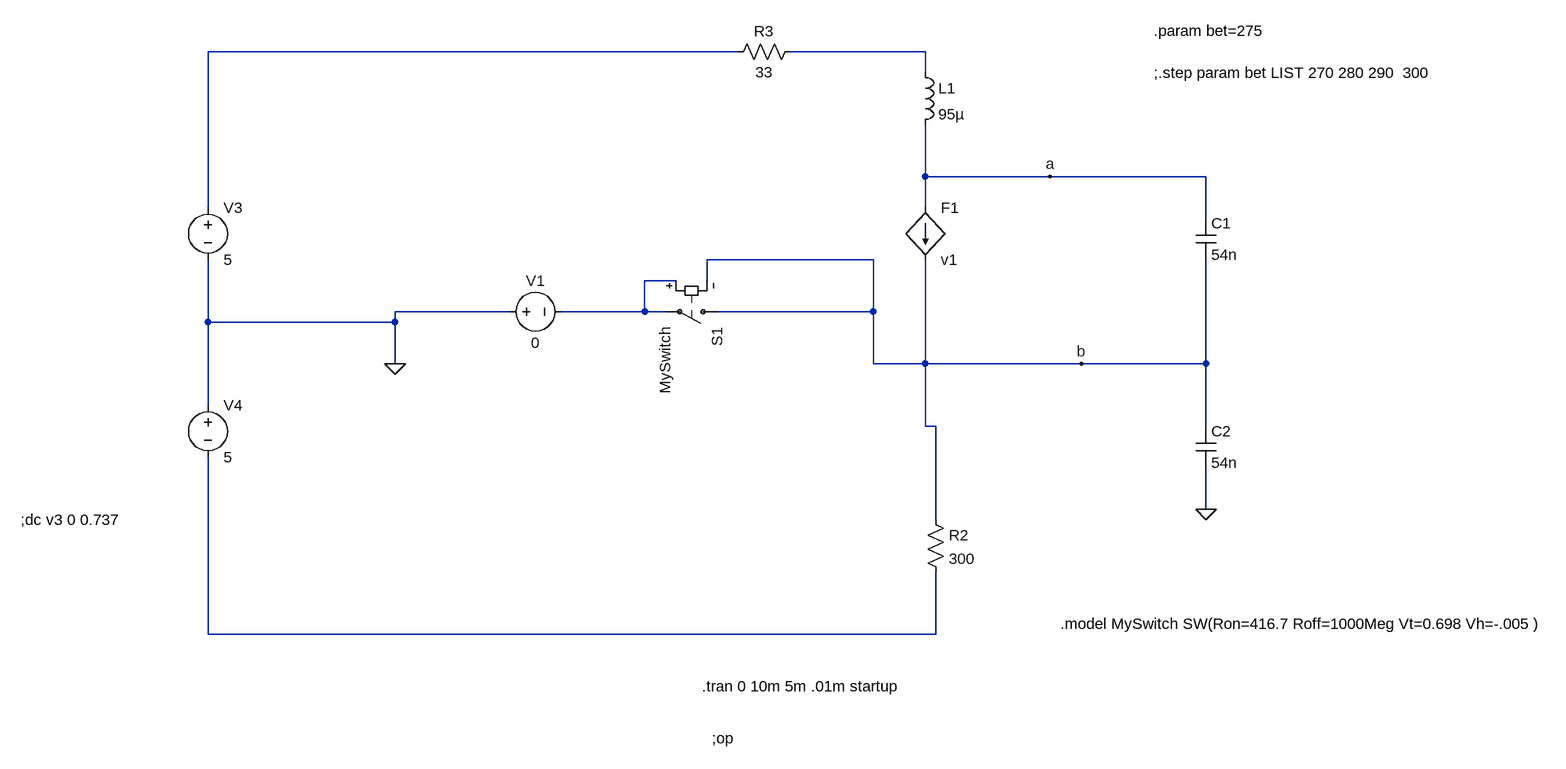
[diagram p0: schematic Colpitts_caos3.asc]
Colpitts_caos3.asc, the LTspice schematic file:
Version 4
SHEET 1 1576 852
WIRE 32 -224 -784 -224
WIRE 320 -224 112 -224
WIRE 320 -192 320 -224
WIRE 320 -32 320 -112
WIRE 512 -32 320 -32
WIRE 752 -32 512 -32
WIRE -784 16 -784 -224
WIRE 320 16 320 -32
WIRE 752 32 752 -32
WIRE 240 96 -16 96
WIRE -64 128 -112 128
WIRE -16 128 -16 96
WIRE -320 176 -496 176
WIRE -112 176 -112 128
WIRE -112 176 -240 176
WIRE -80 176 -112 176
WIRE 240 176 240 96
WIRE 240 176 0 176
WIRE -784 192 -784 96
WIRE -496 192 -496 176
WIRE -496 192 -784 192
WIRE -496 256 -496 192
WIRE 240 256 240 176
WIRE 320 256 320 96
WIRE 320 256 240 256
WIRE 560 256 320 256
WIRE 752 256 752 96
WIRE 752 256 560 256
WIRE -784 320 -784 192
WIRE 320 352 320 256
WIRE 336 352 320 352
WIRE 752 352 752 256
WIRE 752 480 752 416
WIRE 336 496 336 352
WIRE -784 672 -784 400
WIRE 336 672 336 576
WIRE 336 672 -784 672
FLAG -496 256 0
FLAG 752 480 0
FLAG 512 -32 a
FLAG 560 256 b
SYMBOL f 320 16 R0
SYMATTR InstName F1
SYMATTR Value v1
SYMATTR Value2 {bet}
SYMBOL voltage -784 0 R0
WINDOW 123 0 0 Left 2
WINDOW 39 0 0 Left 2
SYMATTR InstName V3
SYMATTR Value 5
SYMBOL voltage -784 304 R0
WINDOW 123 0 0 Left 2
WINDOW 39 0 0 Left 2
SYMATTR InstName V4
SYMATTR Value 5
SYMBOL res 320 480 R0
SYMATTR InstName R2
SYMATTR Value 300
SYMBOL ind 304 -208 R0
SYMATTR InstName L1
SYMATTR Value 95µ
SYMBOL res 128 -240 R90
WINDOW 0 0 56 VBottom 2
WINDOW 3 32 56 VTop 2
SYMATTR InstName R3
SYMATTR Value 33
SYMBOL cap 736 32 R0
SYMATTR InstName C1
SYMATTR Value 54n
SYMBOL cap 736 352 R0
SYMATTR InstName C2
SYMATTR Value 54n
SYMBOL sw 16 176 R90
SYMATTR InstName S1
SYMATTR Value MySwitch
SYMBOL voltage -336 176 R270
WINDOW 0 32 56 VTop 2
WINDOW 3 -32 56 VBottom 2
WINDOW 123 0 0 Left 2
WINDOW 39 0 0 Left 2
SYMATTR InstName V1
SYMATTR Value 0
TEXT -8 832 Left 2 !;op
TEXT -24 752 Left 2 !.tran 0 10m 5m .01m startup
TEXT -1072 496 Left 2 !;dc v3 0 0.737
TEXT 672 -256 Left 2 !.param bet=275
TEXT 672 -192 Left 2 !;.step param bet LIST 270 280 290  300
TEXT 528 656 Left 2 !.model MySwitch SW(Ron=416.7 Roff=1000Meg Vt=0.698 Vh=-.005 )

The netlist it stands for:
* Colpitts_caos3.asc
F1 a b v1 {bet}
V3 N001 0 5
V4 0 N004 5
R2 b N004 300
L1 N002 a 95µ
R3 N002 N001 33
C1 a b 54n
C2 b 0 54n
S1 b N003 N003 b MySwitch
V1 0 N003 0
;op
.tran 0 10m 5m .01m startup
;dc v3 0 0.737
.param bet=275
;.step param bet LIST 270 280 290  300
.model MySwitch SW(Ron=416.7 Roff=1000Meg Vt=0.698 Vh=-.005 )
.backanno
.end